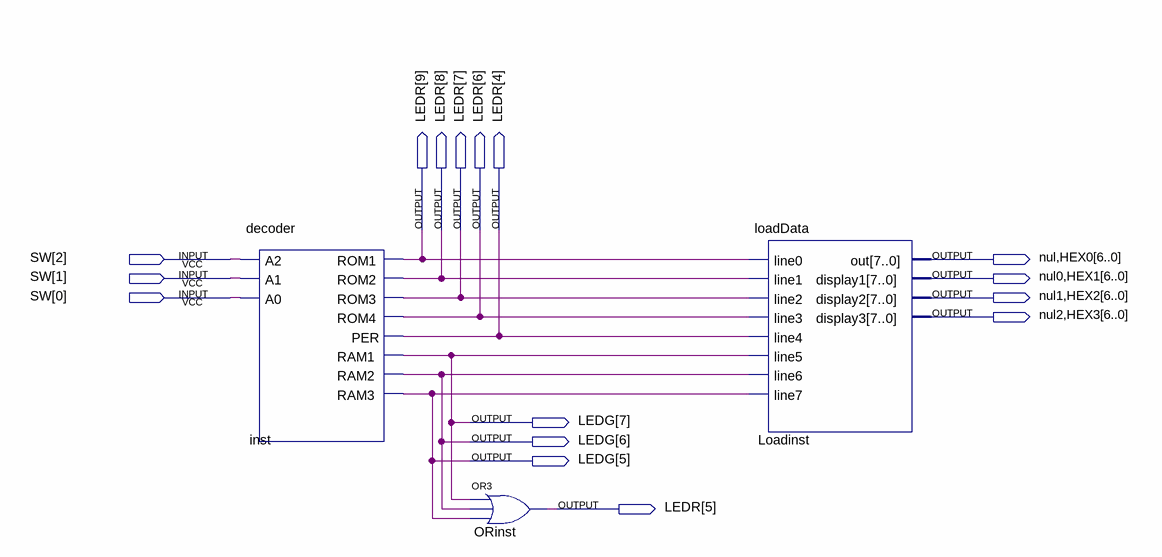
[diagram p0: schematic sheet]
// Quartus schematic MemDecoder.bdf as structural Verilog: 3 symbols, 16 pins
module MemDecoder (
  input  [2:0] SW,
  output [9:4] LEDR,
  output nul,
  output [6:0] HEX0,
  output nul0,
  output [6:0] HEX1,
  output nul1,
  output [6:0] HEX2,
  output nul2,
  output [6:0] HEX3,
  output [7:5] LEDG
);

  decoder inst (
    .A2(SW[2]), .A1(SW[1]), .A0(SW[0]), .ROM1(LEDR[9]), .ROM2(LEDR[8]), .ROM3(LEDR[7]), .ROM4(LEDR[6]),
    .PER(LEDR[4]), .RAM1(LEDG[7]), .RAM2(LEDG[6]), .RAM3(LEDG[5]));
  or ORinst (LEDR[5], LEDG[7], LEDG[6], LEDG[5]);
  loadData Loadinst (
    .line0(LEDR[9]), .line1(LEDR[8]), .line2(LEDR[7]), .line3(LEDR[6]), .line4(LEDR[4]), .line5(LEDG[7]),
    .line6(LEDG[6]), .line7(LEDG[5]), .out({nul, HEX0}), .display1({nul0, HEX1}), .display2({nul1, HEX2}),
    .display3({nul2, HEX3}));
endmodule
